# Altium schematic sheet S7CAS-PLEIADES-CARTE-MERE_Pxx_FPGA_bank0_to_2.SchDoc
size Tabloid; Date: Date; Author: Author 1; Revision: 1; SheetNumber: 3; SheetTotal: 4; Size: 11x17; Sheet_Name: Sheet Description
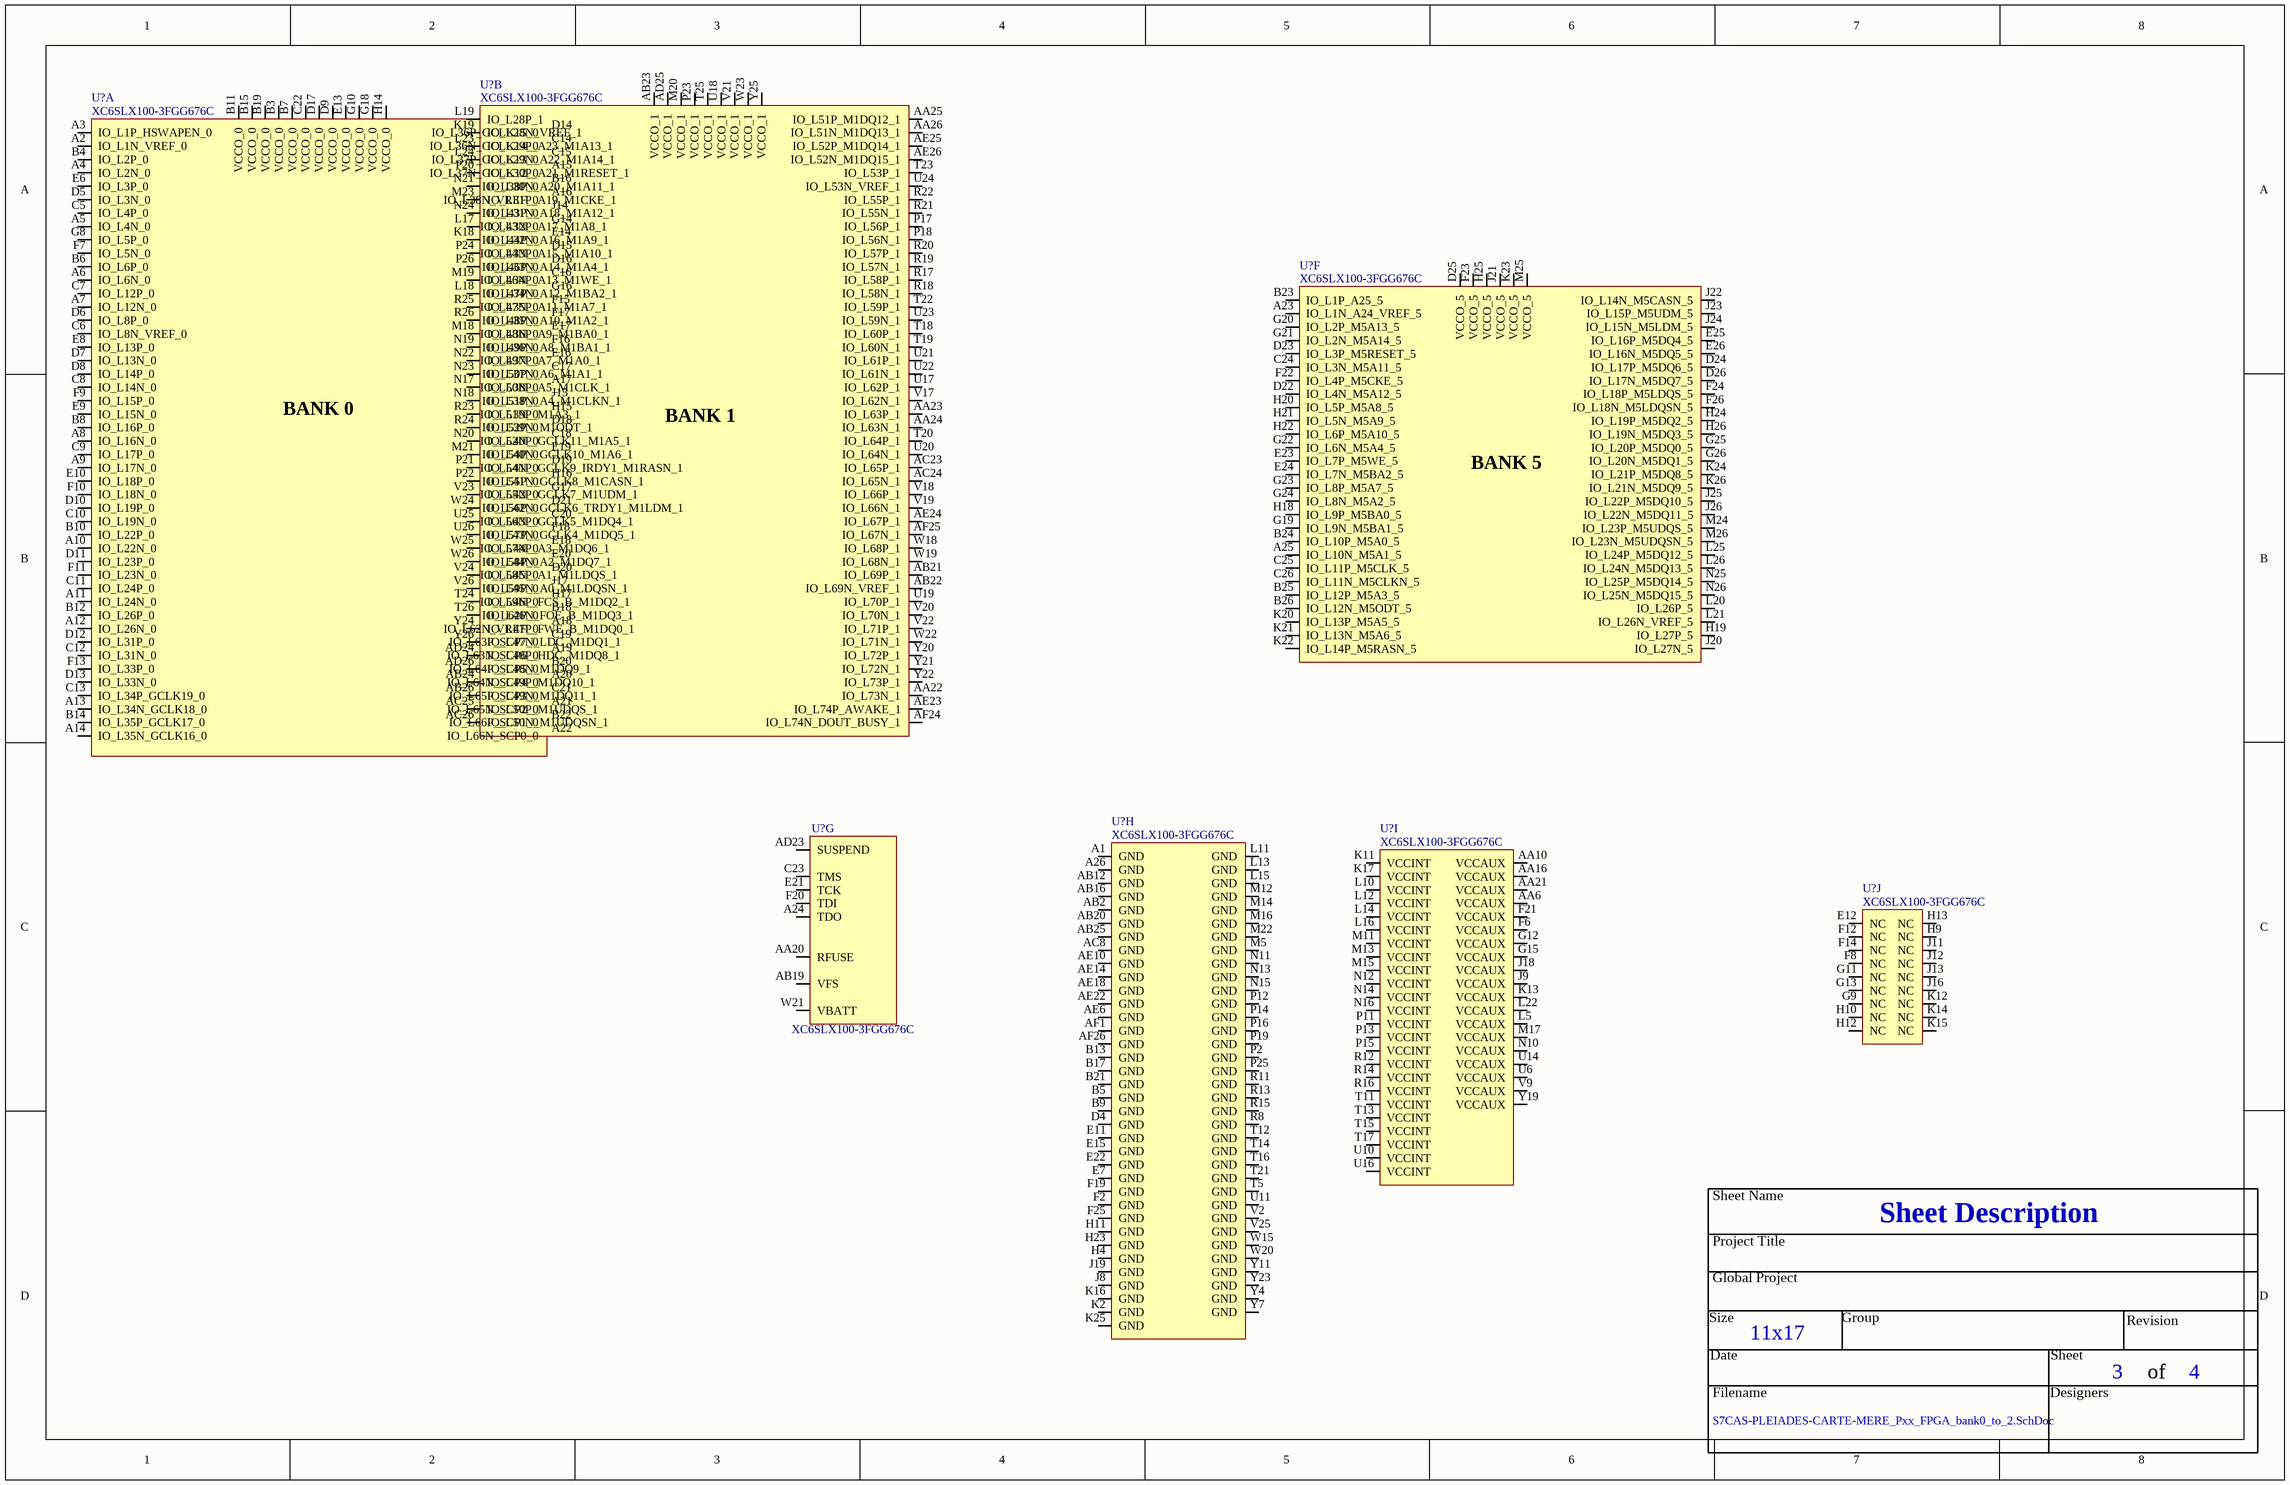
[diagram p0: S7CAS-PLEIADES-CARTE-MERE_Pxx_FPGA_bank0_to_2.SchDoc]

## Parts
(Parts that share a designator on the sheet are numbered #1, #2 ... from top to bottom, then left to right.)
U?#1  XC6SLX100-3FGG676C  [FPGA_XILINX_FGG676]  (part B of 10)
U?#2  XC6SLX100-3FGG676C  [FPGA_XILINX_FGG676]  (part A of 10)
U?#3  XC6SLX100-3FGG676C  [FPGA_XILINX_FGG676]  (part F of 10)
U?#4  XC6SLX100-3FGG676C  [FPGA_XILINX_FGG676]  (part G of 10)
U?#5  XC6SLX100-3FGG676C  [FPGA_XILINX_FGG676]  (part H of 10)
U?#6  XC6SLX100-3FGG676C  [FPGA_XILINX_FGG676]  (part I of 10)
U?#7  XC6SLX100-3FGG676C  [FPGA_XILINX_FGG676]  (part J of 10)

## Nets

Not connected (* = marked no-connect by the designer): U?#1 AA22(IO_L73N_1) AA23(IO_L63P_1) AA24(IO_L63N_1) AA25(IO_L51P_M1DQ12_1) AA26(IO_L51N_M1DQ13_1) AB21(IO_L69P_1) AB22(IO_L69N_VREF_1) AB23(VCCO_1) AB24(IO_L49P_M1DQ10_1) AB26(IO_L49N_M1DQ11_1) AC23(IO_L65P_1) AC24(IO_L65N_1) AC25(IO_L50P_M1UDQS_1) AC26(IO_L50N_M1UDQSN_1) AD24(IO_L48P_HDC_M1DQ8_1) AD25(VCCO_1) AD26(IO_L48N_M1DQ9_1) AE23(IO_L74P_AWAKE_1) AE24(IO_L67P_1) AE25(IO_L52P_M1DQ14_1) AE26(IO_L52N_M1DQ15_1) AF24(IO_L74N_DOUT_BUSY_1) AF25(IO_L67N_1) K18(IO_L32N_A16_M1A9_1) K19(IO_L28N_VREF_1) L17(IO_L32P_A17_M1A8_1) L18(IO_L34N_A12_M1BA2_1) L19(IO_L28P_1) L23(IO_L29P_A23_M1A13_1) L24(IO_L29N_A22_M1A14_1) M18(IO_L36P_A9_M1BA0_1) M19(IO_L34P_A13_M1WE_1) M20(VCCO_1) M21(IO_L40N_GCLK10_M1A6_1) M23(IO_L31P_A19_M1CKE_1) N17(IO_L38P_A5_M1CLK_1) N18(IO_L38N_A4_M1CLKN_1) N19(IO_L36N_A8_M1BA1_1) N20(IO_L40P_GCLK11_M1A5_1) N21(IO_L30N_A20_M1A11_1) N22(IO_L37P_A7_M1A0_1) N23(IO_L37N_A6_M1A1_1) N24(IO_L31N_A18_M1A12_1) P17(IO_L56P_1) P18(IO_L56N_1) P20(IO_L30P_A21_M1RESET_1) P21(IO_L41P_GCLK9_IRDY1_M1RASN_1) P22(IO_L41N_GCLK8_M1CASN_1) P23(VCCO_1) P24(IO_L33P_A15_M1A10_1) P26(IO_L33N_A14_M1A4_1) R17(IO_L58P_1) R18(IO_L58N_1) R19(IO_L57N_1) R20(IO_L57P_1) R21(IO_L55N_1) R22(IO_L55P_1) R23(IO_L39P_M1A3_1) R24(IO_L39N_M1ODT_1) R25(IO_L35P_A11_M1A7_1) R26(IO_L35N_A10_M1A2_1) T18(IO_L60P_1) T19(IO_L60N_1) T20(IO_L64P_1) T22(IO_L59P_1) T23(IO_L53P_1) T24(IO_L46P_FCS_B_M1DQ2_1) T25(VCCO_1) T26(IO_L46N_FOE_B_M1DQ3_1) U17(IO_L62P_1) U18(VCCO_1) U19(IO_L70P_1) U20(IO_L64N_1) U21(IO_L61P_1) U22(IO_L61N_1) U23(IO_L59N_1) U24(IO_L53N_VREF_1) U25(IO_L43P_GCLK5_M1DQ4_1) U26(IO_L43N_GCLK4_M1DQ5_1) V17(IO_L62N_1) V18(IO_L66P_1) V19(IO_L66N_1) V20(IO_L70N_1) V21(VCCO_1) V22(IO_L71P_1) V23(IO_L42P_GCLK7_M1UDM_1) V24(IO_L45P_A1_M1LDQS_1) V26(IO_L45N_A0_M1LDQSN_1) W18(IO_L68P_1) W19(IO_L68N_1) W22(IO_L71N_1) W23(VCCO_1) W24(IO_L42N_GCLK6_TRDY1_M1LDM_1) W25(IO_L44P_A3_M1DQ6_1) W26(IO_L44N_A2_M1DQ7_1) Y20(IO_L72P_1) Y21(IO_L72N_1) Y22(IO_L73P_1) Y24(IO_L47P_FWE_B_M1DQ0_1) Y25(VCCO_1) Y26(IO_L47N_LDC_M1DQ1_1); U?#2 A2(IO_L1N_VREF_0) A3(IO_L1P_HSWAPEN_0) A4(IO_L2N_0) A5(IO_L4N_0) A6(IO_L6N_0) A7(IO_L12N_0) A8(IO_L16N_0) A9(IO_L17N_0) A10(IO_L22N_0) A11(IO_L24N_0) A12(IO_L26N_0) A13(IO_L34N_GCLK18_0) A14(IO_L35N_GCLK16_0) A15(IO_L37N_GCLK12_0) A16(IO_L38N_VREF_0) A17(IO_L50N_0) A18(IO_L62N_VREF_0) A19(IO_L63N_SCP6_0) A20(IO_L64N_SCP4_0) A21(IO_L65N_SCP2_0) A22(IO_L66N_SCP0_0) B3(VCCO_0) B4(IO_L2P_0) B6(IO_L6P_0) B7(VCCO_0) B8(IO_L16P_0) B10(IO_L22P_0) B11(VCCO_0) B12(IO_L26P_0) B14(IO_L35P_GCLK17_0) B15(VCCO_0) B16(IO_L38P_0) B18(IO_L62P_0) B19(VCCO_0) B20(IO_L64P_SCP5_0) B22(IO_L66P_SCP1_0) C5(IO_L4P_0) C6(IO_L8N_VREF_0) C7(IO_L12P_0) C8(IO_L14N_0) C9(IO_L17P_0) C10(IO_L19N_0) C11(IO_L24P_0) C12(IO_L31N_0) C13(IO_L34P_GCLK19_0) C14(IO_L36N_GCLK14_0) C15(IO_L37P_GCLK13_0) C16(IO_L46N_0) C17(IO_L50P_0) C18(IO_L52N_0) C19(IO_L63P_SCP7_0) C20(IO_L56N_0) C21(IO_L65P_SCP3_0) C22(VCCO_0) D5(IO_L3N_0) D6(IO_L8P_0) D7(IO_L13N_0) D8(IO_L14P_0) D9(VCCO_0) D10(IO_L19P_0) D11(IO_L23P_0) D12(IO_L31P_0) D13(IO_L33N_0) D14(IO_L36P_GCLK15_0) D15(IO_L44N_0) D16(IO_L46P_0) D17(VCCO_0) D18(IO_L52P_0) D19(IO_L54N_0) D20(IO_L58N_0) D21(IO_L56P_0) E6(IO_L3P_0) E8(IO_L13P_0) E9(IO_L15N_0) E10(IO_L18P_0) E13(VCCO_0) E14(IO_L44P_0) E16(IO_L49N_0) E17(IO_L48N_0) E18(IO_L57N_0) E19(IO_L54P_0) E20(IO_L58P_0) F7(IO_L5N_0) F9(IO_L15P_0) F10(IO_L18N_0) F11(IO_L23N_0) F13(IO_L33P_0) F15(IO_L47N_0) F16(IO_L49P_0) F17(IO_L48P_0) F18(IO_L57P_0) G8(IO_L5P_0) G10(VCCO_0) G14(IO_L43N_0) G16(IO_L47P_0) G17(IO_L55N_0) G18(VCCO_0) H14(VCCO_0) H15(IO_L51N_0) H16(IO_L55P_0) H17(IO_L59N_0) J14(IO_L43P_0) J15(IO_L51P_0) J17(IO_L59P_0); U?#3 A23(IO_L1N_A24_VREF_5) A25(IO_L10N_M5A1_5) B23(IO_L1P_A25_5) B24(IO_L10P_M5A0_5) B25(IO_L12P_M5A3_5) B26(IO_L12N_M5ODT_5) C24(IO_L3N_M5A11_5) C25(IO_L11P_M5CLK_5) C26(IO_L11N_M5CLKN_5) D22(IO_L4N_M5A12_5) D23(IO_L3P_M5RESET_5) D24(IO_L17P_M5DQ6_5) D25(VCCO_5) D26(IO_L17N_M5DQ7_5) E23(IO_L7P_M5WE_5) E24(IO_L7N_M5BA2_5) E25(IO_L16P_M5DQ4_5) E26(IO_L16N_M5DQ5_5) F22(IO_L4P_M5CKE_5) F23(VCCO_5) F24(IO_L18P_M5LDQS_5) F26(IO_L18N_M5LDQSN_5) G19(IO_L9N_M5BA1_5) G20(IO_L2P_M5A13_5) G21(IO_L2N_M5A14_5) G22(IO_L6N_M5A4_5) G23(IO_L8P_M5A7_5) G24(IO_L8N_M5A2_5) G25(IO_L20P_M5DQ0_5) G26(IO_L20N_M5DQ1_5) H18(IO_L9P_M5BA0_5) H19(IO_L27P_5) H20(IO_L5P_M5A8_5) H21(IO_L5N_M5A9_5) H22(IO_L6P_M5A10_5) H24(IO_L19P_M5DQ2_5) H25(VCCO_5) H26(IO_L19N_M5DQ3_5) J20(IO_L27N_5) J21(VCCO_5) J22(IO_L14N_M5CASN_5) J23(IO_L15P_M5UDM_5) J24(IO_L15N_M5LDM_5) J25(IO_L22P_M5DQ10_5) J26(IO_L22N_M5DQ11_5) K20(IO_L13P_M5A5_5) K21(IO_L13N_M5A6_5) K22(IO_L14P_M5RASN_5) K23(VCCO_5) K24(IO_L21P_M5DQ8_5) K26(IO_L21N_M5DQ9_5) L20(IO_L26P_5) L21(IO_L26N_VREF_5) L25(IO_L24P_M5DQ12_5) L26(IO_L24N_M5DQ13_5) M24(IO_L23P_M5UDQS_5) M25(VCCO_5) M26(IO_L23N_M5UDQSN_5) N25(IO_L25P_M5DQ14_5) N26(IO_L25N_M5DQ15_5); U?#4 A24(TDO) AA20(RFUSE) AB19(VFS) AD23(SUSPEND) C23(TMS) E21(TCK) F20(TDI) W21(VBATT); U?#5 A1(GND) A26(GND) AB2(GND) AB12(GND) AB16(GND) AB20(GND) AB25(GND) AC8(GND) AE6(GND) AE10(GND) AE14(GND) AE18(GND) AE22(GND) AF1(GND) AF26(GND) B5(GND) B9(GND) B13(GND) B17(GND) B21(GND) D4(GND) E7(GND) E11(GND) E15(GND) E22(GND) F2(GND) F19(GND) F25(GND) H4(GND) H11(GND) H23(GND) J8(GND) J19(GND) K2(GND) K16(GND) K25(GND) L11(GND) L13(GND) L15(GND) M5(GND) M12(GND) M14(GND) M16(GND) M22(GND) N11(GND) N13(GND) N15(GND) P2(GND) P12(GND) P14(GND) P16(GND) P19(GND) P25(GND) R8(GND) R11(GND) R13(GND) R15(GND) T5(GND) T12(GND) T14(GND) T16(GND) T21(GND) U11(GND) V2(GND) V25(GND) W15(GND) W20(GND) Y4(GND) Y7(GND) Y11(GND) Y23(GND); U?#6 AA6(VCCAUX) AA10(VCCAUX) AA16(VCCAUX) AA21(VCCAUX) F6(VCCAUX) F21(VCCAUX) G12(VCCAUX) G15(VCCAUX) J9(VCCAUX) J18(VCCAUX) K11(VCCINT) K13(VCCAUX) K17(VCCINT) L5(VCCAUX) L10(VCCINT) L12(VCCINT) L14(VCCINT) L16(VCCINT) L22(VCCAUX) M11(VCCINT) M13(VCCINT) M15(VCCINT) M17(VCCAUX) N10(VCCAUX) N12(VCCINT) N14(VCCINT) N16(VCCINT) P11(VCCINT) P13(VCCINT) P15(VCCINT) R12(VCCINT) R14(VCCINT) R16(VCCINT) T11(VCCINT) T13(VCCINT) T15(VCCINT) T17(VCCINT) U6(VCCAUX) U10(VCCINT) U14(VCCAUX) U16(VCCINT) V9(VCCAUX) Y19(VCCAUX); U?#7 E12(NC) F8(NC) F12(NC) F14(NC) G9(NC) G11(NC) G13(NC) H9(NC) H10(NC) H12(NC) H13(NC) J11(NC) J12(NC) J13(NC) J16(NC) K12(NC) K14(NC) K15(NC)

## Notes on the sheet
- Sheet Name
- Project Title
- Global Project
- Revision
- Size
- Date
- Group
- Sheet
- of
- Filename
- Designers
- (in symbol FPGA_XC6SLX100-3FGG676C, part A) BANK 0
- (in symbol FPGA_XC6SLX100-3FGG676C, part B) BANK 1
- (in symbol FPGA_XC6SLX100-3FGG676C, part F) BANK 5

## Library data of the parts
U?#1-U?#7 = FPGA_XC6SLX100-3FGG676C: FPGA - XILINX SPARTAN 6 480 I/O - BGA-676; Voltage: 1.14 V ~ 1.26 V; Current: *; Power: *; Mfg: Xilinx; Mfg Part Number: XC6SLX100-3FGG676C; HelpURL: https://www.xilinx.com/support/documentation/data_sheets/ds162.pdf; CreatedBy: Jonathan Bouchard; Temperature: 0°C ~ 85°C (TJ); Value: *; Precision: *; Package: BGA-676; Supplier 1: Digikey; Supplier Part Number 1: 122-1760-ND